# Altium schematic sheet ADC.SchDoc
size A4
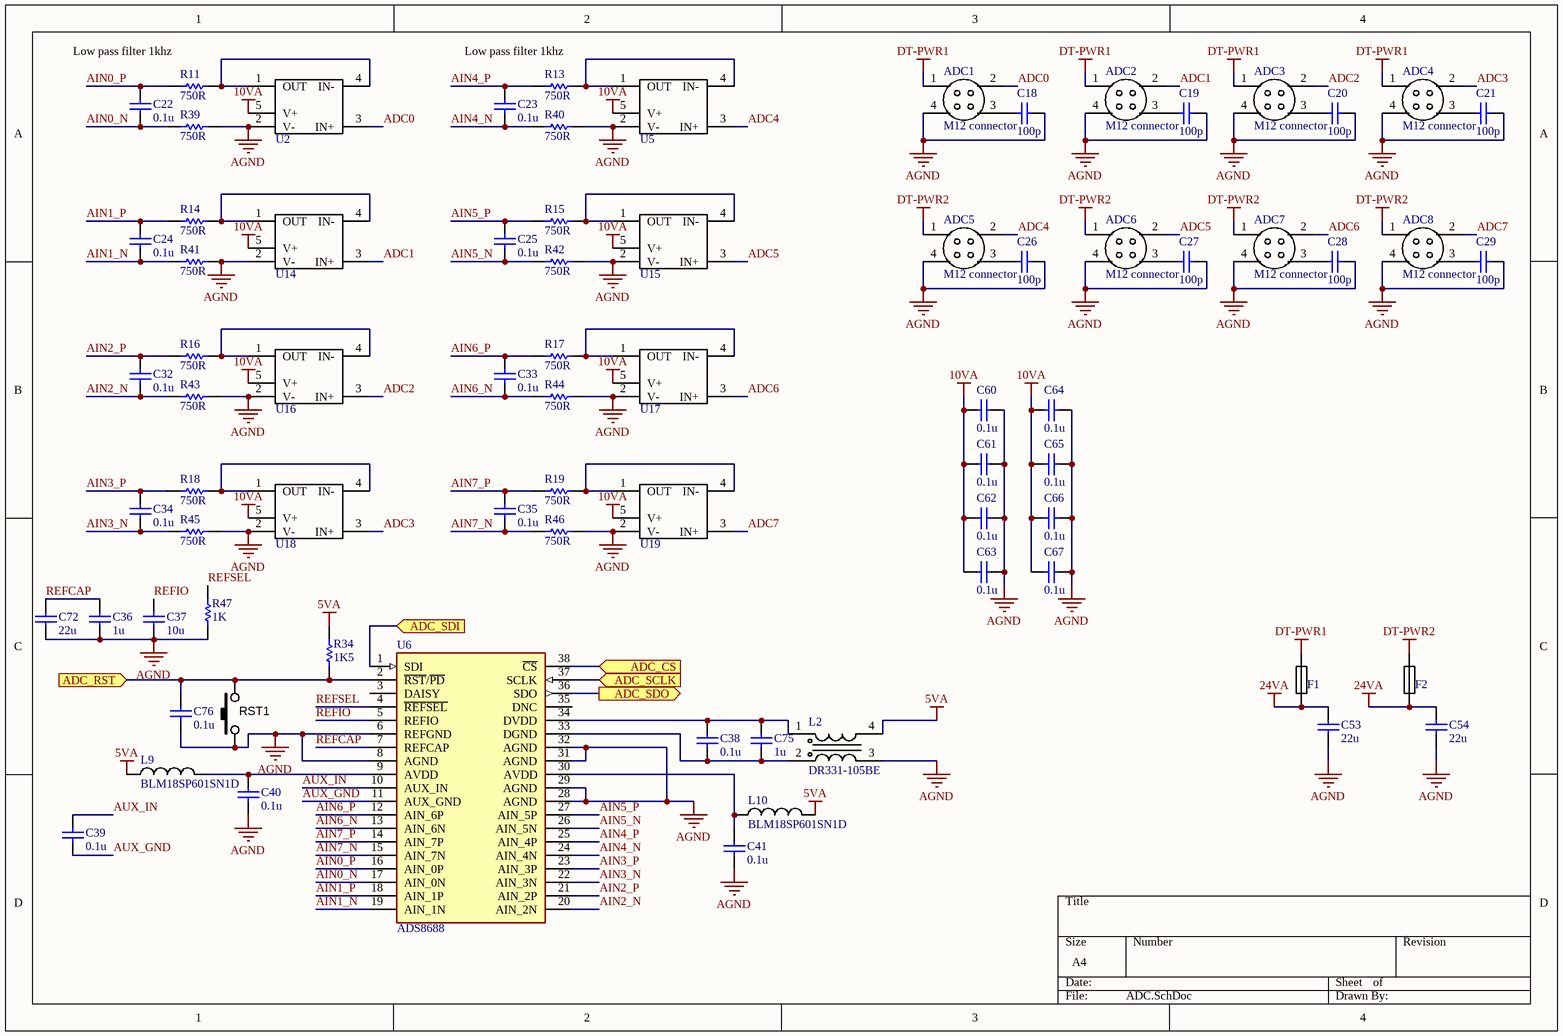
[diagram p0: ADC.SchDoc]

## Parts
ADC1  M12 connector  [GX12_PCB_Mount]
ADC2  M12 connector  [GX12_PCB_Mount]
ADC3  M12 connector  [GX12_PCB_Mount]
ADC4  M12 connector  [GX12_PCB_Mount]
ADC5  M12 connector  [GX12_PCB_Mount]
ADC6  M12 connector  [GX12_PCB_Mount]
ADC7  M12 connector  [GX12_PCB_Mount]
ADC8  M12 connector  [GX12_PCB_Mount]
C18  value 100p  [CAPC1608X90N]  (hidden comment: Cap)
C19  value 100p  [CAPC1608X90N]  (hidden comment: Cap)
C20  value 100p  [CAPC1608X90N]  (hidden comment: Cap)
C21  value 100p  [CAPC1608X90N]  (hidden comment: Cap)
C22  value 0.1u  [CAPC1608X90N]  (hidden comment: Cap)
C23  value 0.1u  [CAPC1608X90N]  (hidden comment: Cap)
C24  value 0.1u  [CAPC1608X90N]  (hidden comment: Cap)
C25  value 0.1u  [CAPC1608X90N]  (hidden comment: Cap)
C26  value 100p  [CAPC1608X90N]  (hidden comment: Cap)
C27  value 100p  [CAPC1608X90N]  (hidden comment: Cap)
C28  value 100p  [CAPC1608X90N]  (hidden comment: Cap)
C29  value 100p  [CAPC1608X90N]  (hidden comment: Cap)
C32  value 0.1u  [CAPC1608X90N]  (hidden comment: Cap)
C33  value 0.1u  [CAPC1608X90N]  (hidden comment: Cap)
C34  value 0.1u  [CAPC1608X90N]  (hidden comment: Cap)
C35  value 0.1u  [CAPC1608X90N]  (hidden comment: Cap)
C36  value 1u  [CAPC1608X90N]  (hidden comment: Cap)
C37  value 10u  [CAPC1608X90N]  (hidden comment: Cap)
C38  value 0.1u  [CAPC1608X90N]  (hidden comment: Cap)
C39  value 0.1u  [CAPC1608X90N]  (hidden comment: Cap)
C40  value 0.1u  [CAPC1608X90N]  (hidden comment: Cap)
C41  value 0.1u  [CAPC1608X90N]  (hidden comment: Cap)
C53  value 22u  [CAPC2012X135N]  (hidden comment: Cap)
C54  value 22u  [CAPC2012X135N]  (hidden comment: Cap)
C60  value 0.1u  [CAPC1608X90N]  (hidden comment: Cap)
C61  value 0.1u  [CAPC1608X90N]  (hidden comment: Cap)
C62  value 0.1u  [CAPC1608X90N]  (hidden comment: Cap)
C63  value 0.1u  [CAPC1608X90N]  (hidden comment: Cap)
C64  value 0.1u  [CAPC1608X90N]  (hidden comment: Cap)
C65  value 0.1u  [CAPC1608X90N]  (hidden comment: Cap)
C66  value 0.1u  [CAPC1608X90N]  (hidden comment: Cap)
C67  value 0.1u  [CAPC1608X90N]  (hidden comment: Cap)
C72  value 22u  [CAPC2012X135N]  (hidden comment: Cap)
C75  value 1u  [CAPC1608X90N]  (hidden comment: Cap)
C76  value 0.1u  [CAPC1608X90N]  (hidden comment: Cap)
F1  MFU0805FF00500P100  [RESC2012X70N]  (value not drawn)
F2  MFU0805FF00500P100  [RESC2012X70N]  (value not drawn)
L2  DR331-105BE  [DR331-105BE]
L9  BLM18SP601SN1D  [INDC1608N]
L10  BLM18SP601SN1D  [INDC1608N]
R11  value 750R  [RESC1608X55N]  (hidden comment: Res1)
R13  value 750R  [RESC1608X55N]  (hidden comment: Res1)
R14  value 750R  [RESC1608X55N]  (hidden comment: Res1)
R15  value 750R  [RESC1608X55N]  (hidden comment: Res1)
R16  value 750R  [RESC1608X55N]  (hidden comment: Res1)
R17  value 750R  [RESC1608X55N]  (hidden comment: Res1)
R18  value 750R  [RESC1608X55N]  (hidden comment: Res1)
R19  value 750R  [RESC1608X55N]  (hidden comment: Res1)
R34  value 1K5  [RESC1608X55N]  (hidden comment: Res1)
R39  value 750R  [RESC1608X55N]  (hidden comment: Res1)
R40  value 750R  [RESC1608X55N]  (hidden comment: Res1)
R41  value 750R  [RESC1608X55N]  (hidden comment: Res1)
R42  value 750R  [RESC1608X55N]  (hidden comment: Res1)
R43  value 750R  [RESC1608X55N]  (hidden comment: Res1)
R44  value 750R  [RESC1608X55N]  (hidden comment: Res1)
R45  value 750R  [RESC1608X55N]  (hidden comment: Res1)
R46  value 750R  [RESC1608X55N]  (hidden comment: Res1)
R47  value 1K  [RESC1608X55N]  (hidden comment: Res1)
RST1  SW_THT_PB_4.3mm  [TACT_SWT-SMD-4.4]  (value not drawn)
U2  OPA196  [SOT23-5]  (value not drawn)
U5  OPA196  [SOT23-5]  (value not drawn)
U6  ADS8688  [TSSOP38]
U14  OPA196  [SOT23-5]  (value not drawn)
U15  OPA196  [SOT23-5]  (value not drawn)
U16  OPA196  [SOT23-5]  (value not drawn)
U17  OPA196  [SOT23-5]  (value not drawn)
U18  OPA196  [SOT23-5]  (value not drawn)
U19  OPA196  [SOT23-5]  (value not drawn)

## Ports
ADC_CS (in), ADC_RST (in), ADC_SCLK (in), ADC_SDI (in), ADC_SDO (out)

## Nets
5VA: L2.4(VOUT+) L9.1 L10.2 R34.2
10VA: C60.2 C61.2 C62.2 C63.2 C64.2 C65.2 C66.2 C67.2 U2.5(V+) U5.5(V+) U14.5(V+) U15.5(V+) U16.5(V+) U17.5(V+) U18.5(V+) U19.5(V+)
24VA: C53.2 C54.2 F1.1 F2.1
AGND: ADC1.4 ADC2.4 ADC3.4 ADC4.4 ADC5.4 ADC6.4 ADC7.4 ADC8.4 C18.1 C19.1 C20.1 C21.1 C26.1 C27.1 C28.1 C29.1 C36.1 C37.1 C40.1 C41.1 C53.1 C54.1 C60.1 C61.1 C62.1 C63.1 C64.1 C65.1 C66.1 C67.1 C72.1 C76.2 L2.3(VOUT+) R39.2 R40.2 R41.2 R42.2 R43.2 R44.2 R45.2 R46.2 R47.1 RST1.1 U2.2(V-) U5.2(V-) U6.6(REFGND) U6.8(AGND) U6.28(AGND) U6.29(AGND) U6.31(AGND) U6.32(AGND) U14.2(V-) U15.2(V-) U16.2(V-) U17.2(V-) U18.2(V-) U19.2(V-)
DT-PWR1: ADC1.1 ADC2.1 ADC3.1 ADC4.1 F1.2
DT-PWR2: ADC5.1 ADC6.1 ADC7.1 ADC8.1 F2.2
ADC0: ADC1.2 U2.3(IN+)
ADC1: ADC2.2 U14.3(IN+)
ADC2: ADC3.2 U16.3(IN+)
ADC3: ADC4.2 U18.3(IN+)
ADC4: ADC5.2 U5.3(IN+)
ADC5: ADC6.2 U15.3(IN+)
ADC6: ADC7.2 U17.3(IN+)
ADC7: ADC8.2 U19.3(IN+)
ADC_CS: U6.38(~{CS}) ; port ADC_CS
ADC_RST: C76.1 R34.1 RST1.2 U6.2(~{RST}/~{PD}) ; port ADC_RST
ADC_SCLK: U6.37(SCLK) ; port ADC_SCLK
ADC_SDI: U6.1(SDI) ; port ADC_SDI
ADC_SDO: U6.36(SDO) ; port ADC_SDO
AIN0_N: C22.1 R39.1 U6.17(AIN_0N)
AIN0_P: C22.2 R11.1 U6.16(AIN_0P)
AIN1_N: C24.1 R41.1 U6.19(AIN_1N)
AIN1_P: C24.2 R14.1 U6.18(AIN_1P)
AIN2_N: C32.1 R43.1 U6.20(AIN_2N)
AIN2_P: C32.2 R16.1 U6.21(AIN_2P)
AIN3_N: C34.1 R45.1 U6.22(AIN_3N)
AIN3_P: C34.2 R18.1 U6.23(AIN_3P)
AIN4_N: C23.1 R40.1 U6.24(AIN_4N)
AIN4_P: C23.2 R13.1 U6.25(AIN_4P)
AIN5_N: C25.1 R42.1 U6.26(AIN_5N)
AIN5_P: C25.2 R15.1 U6.27(AIN_5P)
AIN6_N: C33.1 R44.1 U6.13(AIN_6N)
AIN6_P: C33.2 R17.1 U6.12(AIN_6P)
AIN7_N: C35.1 R46.1 U6.15(AIN_7N)
AIN7_P: C35.2 R19.1 U6.14(AIN_7P)
AUX_GND: C39.1 U6.11(AUX_GND)
AUX_IN: C39.2 U6.10(AUX_IN)
REFCAP: C36.2 C72.2 U6.7(REFCAP)
REFIO: C37.2 U6.5(REFIO)
REFSEL: R47.2 U6.4(~{REFSEL})
NetADC1_3: ADC1.3 C18.2
NetADC2_3: ADC2.3 C19.2
NetADC3_3: ADC3.3 C20.2
NetADC4_3: ADC4.3 C21.2
NetADC5_3: ADC5.3 C26.2
NetADC6_3: ADC6.3 C27.2
NetADC7_3: ADC7.3 C28.2
NetADC8_3: ADC8.3 C29.2
NetC38_1: C38.1 C75.1 L2.2(VOUT+) U6.33(DGND)
NetC38_2: C38.2 C75.2 L2.1(VOUT+) U6.34(DVDD)
NetC40_2: C40.2 L9.2 U6.9(AVDD)
NetC41_2: C41.2 L10.1 U6.30(AVDD)
NetR11_2: R11.2 U2.1(OUT) U2.4(IN-)
NetR13_2: R13.2 U5.1(OUT) U5.4(IN-)
NetR14_2: R14.2 U14.1(OUT) U14.4(IN-)
NetR15_2: R15.2 U15.1(OUT) U15.4(IN-)
NetR16_2: R16.2 U16.1(OUT) U16.4(IN-)
NetR17_2: R17.2 U17.1(OUT) U17.4(IN-)
NetR18_2: R18.2 U18.1(OUT) U18.4(IN-)
NetR19_2: R19.2 U19.1(OUT) U19.4(IN-)

Not connected (* = marked no-connect by the designer): U6 3(DAISY) 35(DNC)

## Notes on the sheet
- Low pass filter 1khz

## Library data of the parts
ADC1-ADC8 = M12_connector: M12 connect with 4 pin, current 4A per terminal; ComponentLink1Description: Purchase; ComponentLink1URL: https://item.taobao.com/item.htm?spm=a230r.1.14.42.72f34373kzOCRP&id=571188244354&ns=1&abbucket=18#detail
C18-C29 C32-C41 C53 C54 C60-C67 C72 C75 C76 = Cap: Capacitor; Published: 8-Jun-2000; LatestRevisionDate: 17-Jul-2002; LatestRevisionNote: Re-released for DXP Platform.; PackageReference: RAD-0.3; Publisher: Altium Limited; PackageDescription: Radial Cap, Thru-Hole; 2 Leads; 0.3 in Pin Spacing
F1 F2 = FUSE_32V_500MA_0805: fuse 32V 0.5A
L2 = DR331-105BE: Common mode choke 1mH 0.5A
L9 L10 = INC_BLM18SP601SN1D: Ferritebead 1.5A, max 600ohm resistance
R11 R13-R19 R34 R39-R47 = Res1: Resistor; Published: 8-Jun-2000; LatestRevisionDate: 17-Jul-2002; LatestRevisionNote: Re-released for DXP Platform.; PackageReference: AXIAL-0.3; Publisher: Altium Limited; PackageDescription: Axial Device, Thru-Hole; 2 Leads; 0.3 in Pin Spacing
RST1 = SW_THT_PB_4.3mm: Switch, tact, 4.3mm stem; Manufacturer 1: Bond-Tact; Manufacturer Part Number 1: TS-1143-WP-300; SCDType: spec; Function: Speed; Package / Case: 6.5x6.5mm; 4.3mm stem; Material: Brass/Nylon/Ag plating
U2 U5 U14-U19 = OPA196: operational amplifier 36V input; Vs: -16 to +16 / 0 to 36V; Offset voltage: 100uV; Iout: -65 to 65mA; ComponentLink1Description: datasheet; ComponentLink1URL: https://www.ti.com/lit/ds/symlink/opa196.pdf?HQS=TI-null-null-mousermode-df-pf-null-wwe&DCM=yes&ref_url=https%3A%2F%2Fwww.mouser.hk%2F&distId=26
U6 = ADS8688: ADC 8 channel, 500KSPS